# Altium schematic sheet Illustrations 3.SchDoc: Illustrations 3
size A4; ApprovedBy: LD Stanton; Author: LD Stanton; CompanyName: University of Cape Town; DrawnBy: Lawrence Stanton; Engineer: Lawrence Stanton; Organization: University of Cape Town; Address1: Department of Electrical Engineering; Address2: Rondebosch; Address3: Cape Town; Address4: South Africa 7701; DocumentNumber: 1; SheetNumber: 1; SheetTotal: 1
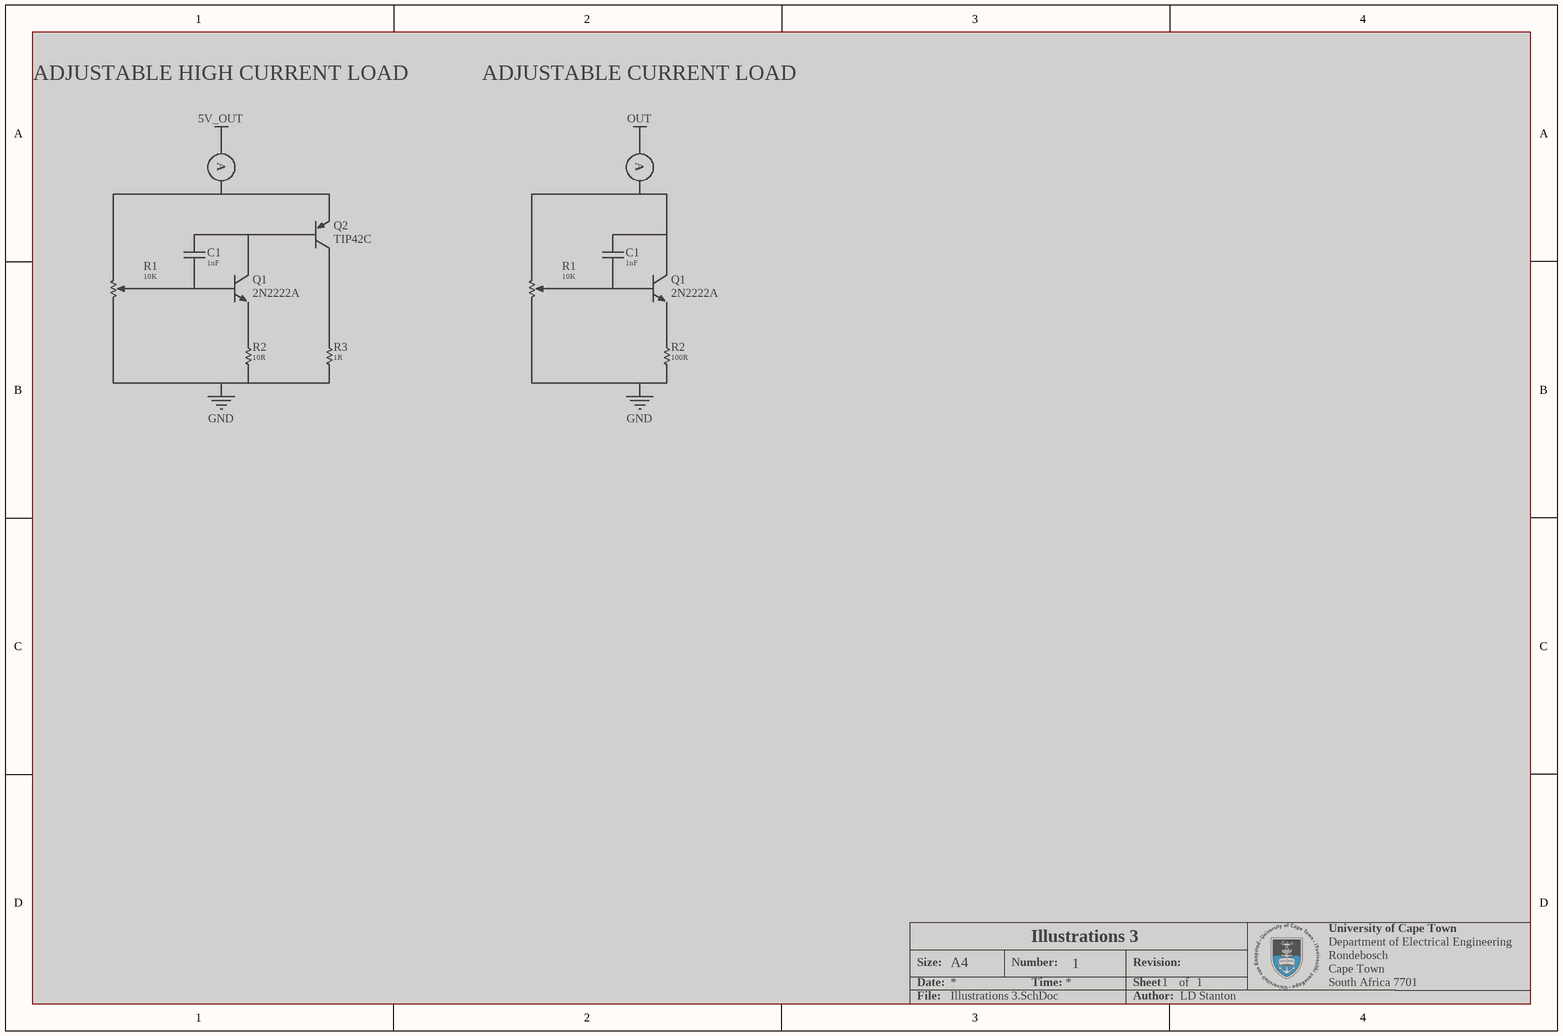
[diagram p0: Illustrations 3.SchDoc]

## Parts
(Parts that share a designator on the sheet are numbered #1, #2 ... from top to bottom, then left to right.)
C1#1  value 1nF  (hidden comment: Capacitor Non-Polarised Illustration)  (graphical)  (masked out: inside a compile mask, not in the netlist)
C1#2  value 1nF  (hidden comment: Capacitor Non-Polarised Illustration)  (graphical)  (masked out: inside a compile mask, not in the netlist)
M?#1  Ammeter Illustration  (value not drawn)  (graphical)  (masked out: inside a compile mask, not in the netlist)
M?#2  Ammeter Illustration  (value not drawn)  (graphical)  (masked out: inside a compile mask, not in the netlist)
Q1#1  2N2222A  (graphical)  (masked out: inside a compile mask, not in the netlist)
Q1#2  2N2222A  (graphical)  (masked out: inside a compile mask, not in the netlist)
Q2  TIP42C  (graphical)  (masked out: inside a compile mask, not in the netlist)
R1#1  value 10K  (hidden comment: Potentiometer Illustration)  (graphical)  (masked out: inside a compile mask, not in the netlist)
R1#2  value 10K  (hidden comment: Potentiometer Illustration)  (graphical)  (masked out: inside a compile mask, not in the netlist)
R2#1  value 10R  (hidden comment: Resistor Wire Illustration)  (graphical)  (masked out: inside a compile mask, not in the netlist)
R2#2  value 100R  (hidden comment: Resistor Wire Illustration)  (graphical)  (masked out: inside a compile mask, not in the netlist)
R3  value 1R  (hidden comment: Resistor Wire Illustration)  (graphical)  (masked out: inside a compile mask, not in the netlist)

## Notes on the sheet
- ADJUSTABLE HIGH CURRENT LOAD
- ADJUSTABLE CURRENT LOAD
- Size:
- Date:
- A4
- Number:
- Time:
- Revision:
- Sheet
- of
- File:
- Author:
- (in symbol CMP-00040-3) A

## Library data of the parts
C1#1 C1#2 = CMP-000003-10: Non-Polarised Capacitor for Illustration.; Tolerance: ±0%; Temperature Coefficient: ±0ppm/K; Placement: CRITICAL; Voltage: 0V; Package: 0000; Temperature: -0 - 0°C
M?#1 M?#2 = CMP-00040-3: Ammeter for Illustration; Placement: CRITICAL
Q1#1 Q1#2 = CMP-000010-3: NPN Bipolar Junction Transistor for Illustration; Collector Current: 0A; Collector-Emitter Voltage: 0V; Power: 0W; Placement: CRITICAL; Temperature: -0 - 0°C; Saturation Voltgae: 0V
Q2 = CMP-00002-3: PNP Bipolar Junction Transistor for Illustration; Placement: CRITICAL; Collector-Emitter Voltage: 0V; Power: 0W; Collector Current: 0A; Saturation Voltgae: 0V; Temperature: -0 - 0°C
R1#1 R1#2 = CMP-010-000362-3: Potentiometer for Illustration.; Working Voltage: 0V; Placement: CRITICAL; Power: 0W; Temperature Coefficient: ±0ppm/K; Tolerance: ±0%; Temperature: -0 - 0°C
R2#1 R2#2 R3 = CMP-010-000361-6: Resistor for Illustration. Wire Symbol.; Temperature Coefficient: ±0ppm/K; Placement: CRITICAL; Power: 0W; Tolerance: ±0%; Working Voltage: 0V; Temperature: -0 - 0°C; Package: 0000